# Altium schematic sheet USB_Converter.SchDoc
size A4; SheetNumber: 1; SheetTotal: 1
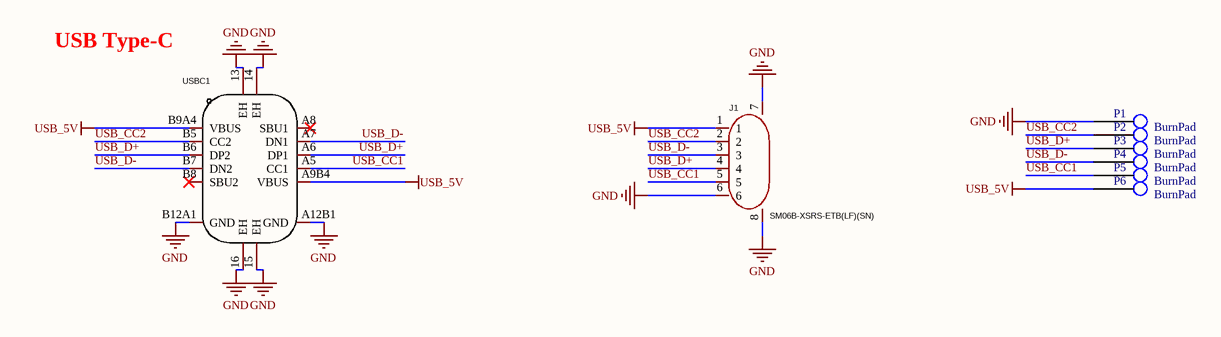
[diagram p0: USB_Converter.SchDoc]

## Parts
J1  SM06B-XSRS-ETB(LF)(SN)  [CONN-SMD_6P-P0.6]
P1  BurnPad  [BurnPad_0.5mm]
P2  BurnPad  [BurnPad_0.5mm]
P3  BurnPad  [BurnPad_0.5mm]
P4  BurnPad  [BurnPad_0.5mm]
P5  BurnPad  [BurnPad_0.5mm]
P6  BurnPad  [BurnPad_0.5mm]
USBC1  918-418K2024S40000  [USB-C-SMD_TYPE-C-USB-4]  (value not drawn)

## Nets
GND: J1.6 J1.7 J1.8 P1.1 USBC1.13(EH) USBC1.14(EH) USBC1.15(EH) USBC1.16(EH) USBC1.A12B1(GND) USBC1.B12A1(GND)
USB_5V: J1.1 P6.1 USBC1.A9B4(VBUS) USBC1.B9A4(VBUS)
USB_CC1: J1.5 P5.1 USBC1.A5(CC1)
USB_CC2: J1.2 P2.1 USBC1.B5(CC2)
USB_D+: J1.4 P3.1 USBC1.A6(DP1) USBC1.B6(DP2)
USB_D-: J1.3 P4.1 USBC1.A7(DN1) USBC1.B7(DN2)

Not connected (* = marked no-connect by the designer): USBC1 A8(SBU1)* B8(SBU2)*

## Notes on the sheet
- USB Type-C
- Title
- Size:
- Date:
- A4
- Number:
- Time:
- Revision:
- Sheet
- of
- 后厂村路直博生
- File:

## Library data of the parts
J1 = SM06B-XSRS-ETB(LF)(SN): Manufacturer: JST; Add into BOM: yes; Pitch: 0.6mm; Current Rating (Max): 200mA; Symbol: SM06B-XSRS-ETB(LF)(SN); Device: SM06B-XSRS-ETB(LF)(SN); LCSC Part Name: SM06B-XSRS-ETB(LF)(SN); Supplier Part: C5306600; Manufacturer Part: SM06B-XSRS-ETB(LF)(SN); Supplier Footprint: SMD,P=0.6mm,卧贴; JLCPCB Part Class: Extended Part; Datasheet: https://atta.szlcsc.com/upload/public/pdf/source/20211104/F92F039D0CBA277DB4B3F7158FB08335.pdf; Supplier: LCSC; Convert to PCB: yes; Mounting Style: 卧贴; Number of Rows: 1; Contact Material: 铜合金; Contact Plating: 锡; Operating Temperature Range: -25℃~+85℃
USBC1 = 918-418K2024S40000: Manufacturer: 精拓金; Symbol: TYPE-C 3.1 MT 16P_C168688; Add into BOM: yes; Connector Type: Type-C; Gender: 母座; Number of Contacts: 16P; Number of Ports: 1; Name: 918-418K2024S40000; Device: 918-418K2024S40000; LCSC Part Name: Type-C 母座; Supplier Part: C168688; Manufacturer Part: 918-418K2024S40000; Supplier Footprint: SMD; JLCPCB Part Class: Extended Part; Datasheet: https://atta.szlcsc.com/upload/public/pdf/source/20230504/AD68741A173EB676C7BDD03FFA4DE90F.pdf; Supplier: LCSC; Convert to PCB: yes; Standard: -